# EAGLE design H15R80 (EAGLE 9.3.0)

## Sheet 1 of 2
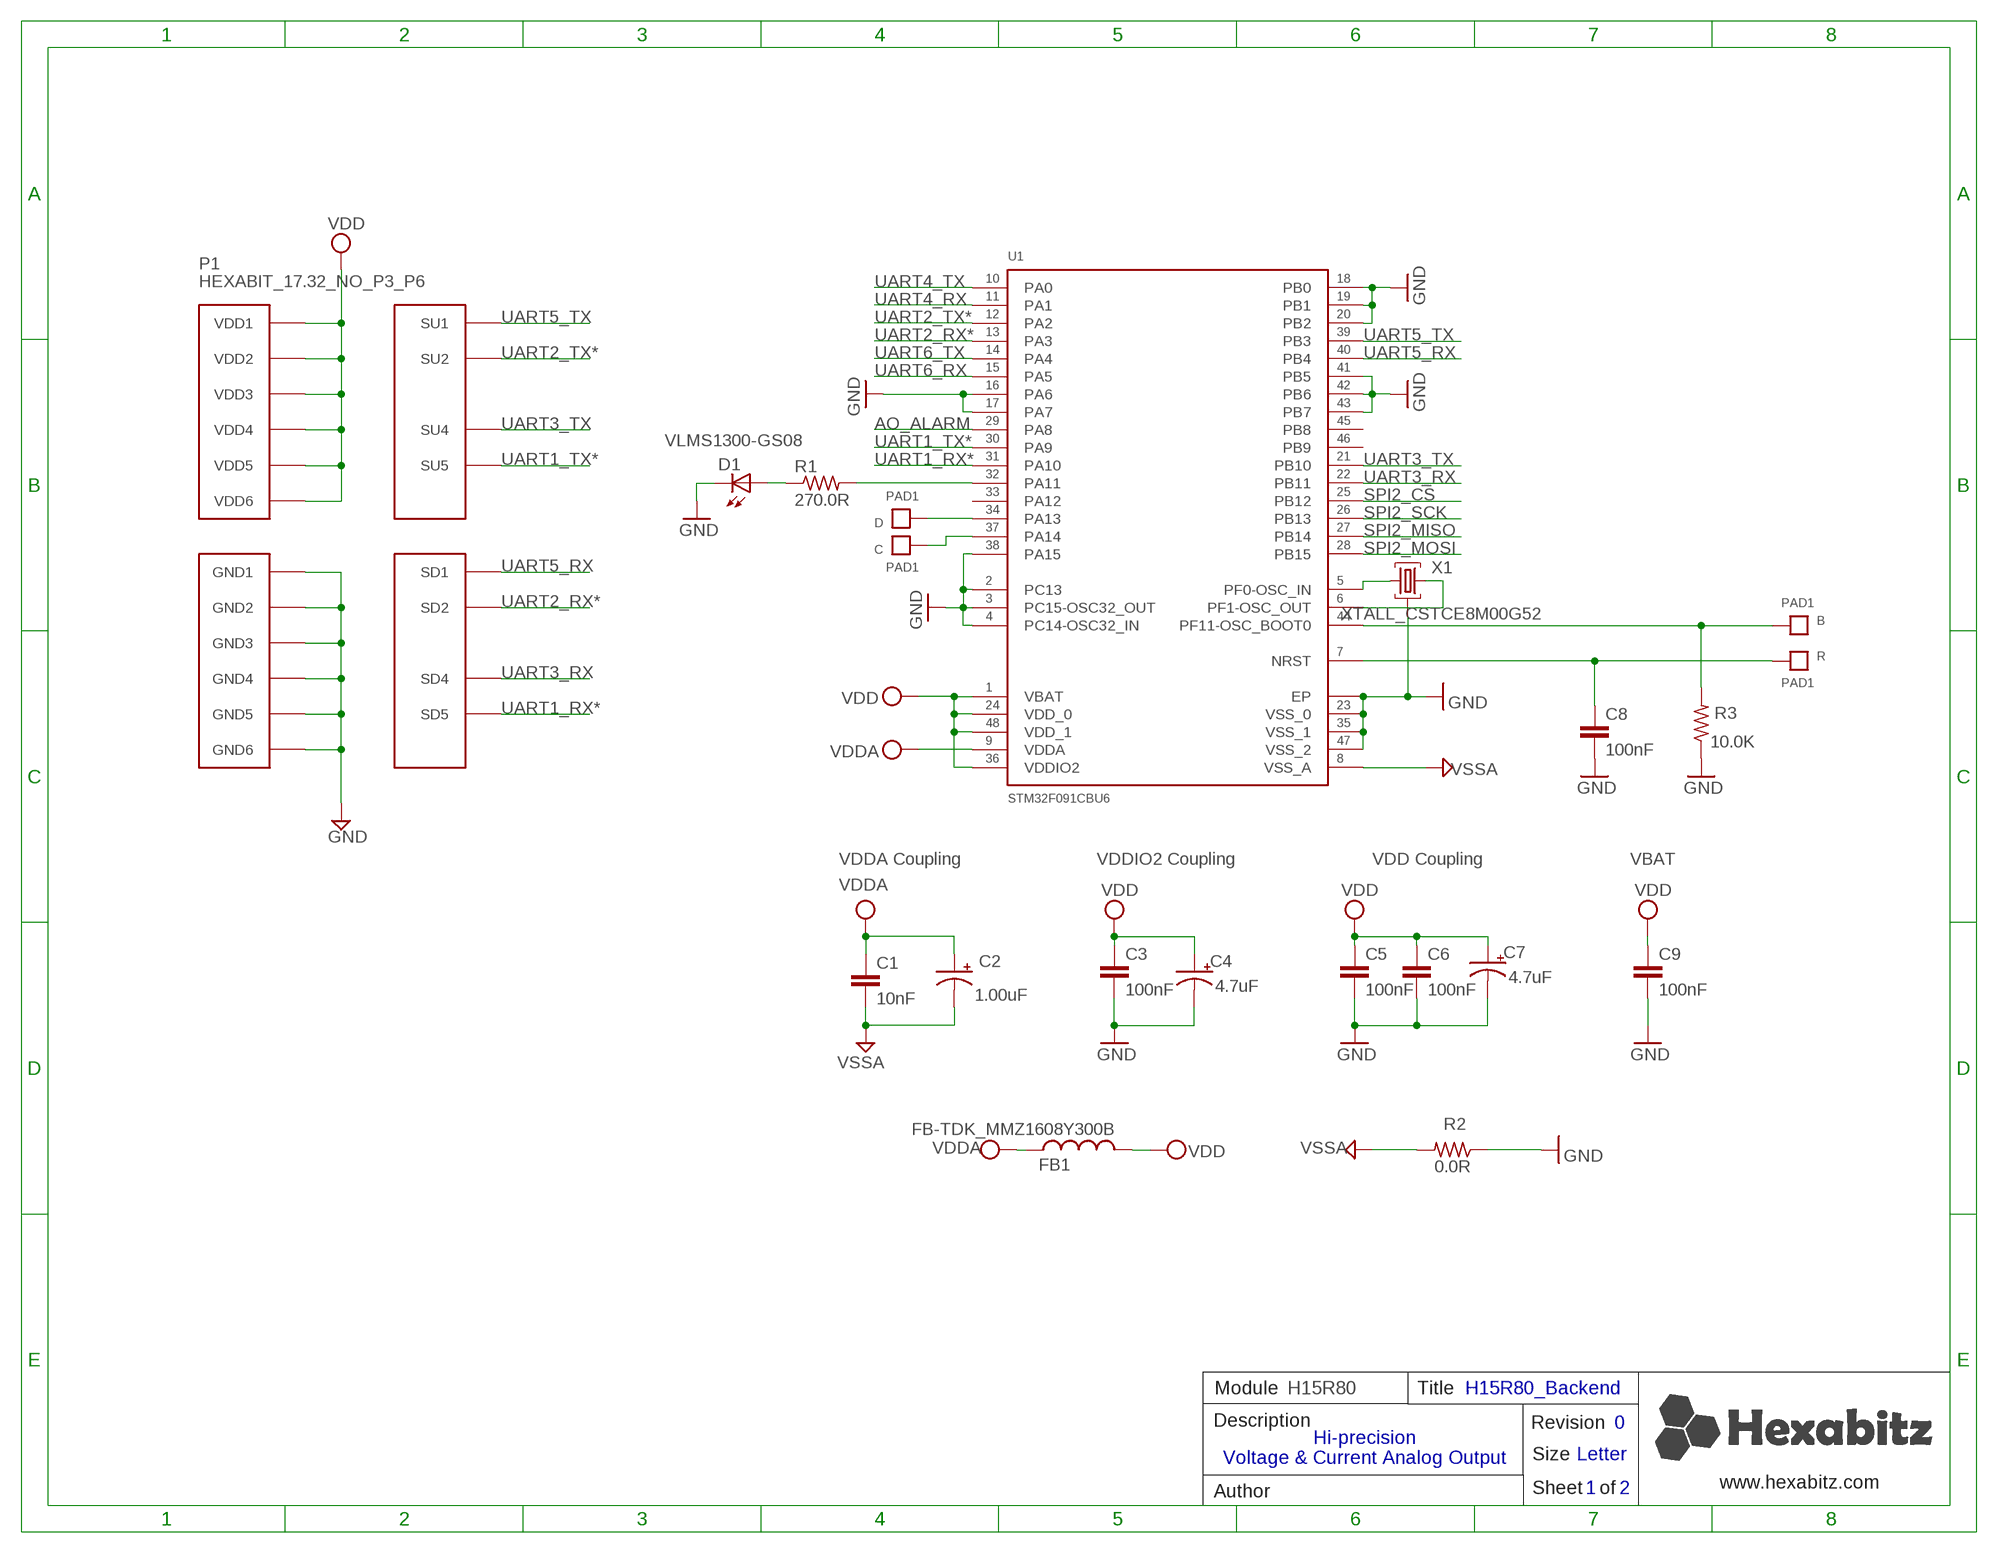
[diagram p0: schematic, sheet 1]

### Parts
B  PAD1  [PAD1]
C  PAD1  [PAD1]
C1  10nF  C-0603  [C-0603]
C2  1.00uF  C-0805-POL  [C-0805-POL]
C3  100nF  C-0603  [C-0603]
C4  4.7uF  C-0805-POL  [C-0805-POL]
C5  100nF  C-0603  [C-0603]
C6  100nF  C-0603  [C-0603]
C7  4.7uF  C-0805-POL  [C-0805-POL]
C8  100nF  C-0603  [C-0603]
C9  100nF  C-0603  [C-0603]
D  PAD1  [PAD1]
D1  VLMS1300-GS08  [VLMS1300-GS08]
FB1  FB-TDK_MMZ1608Y300B  [FB-TDK_MMZ1608Y300B]
P1  HEXABIT_17.32_NO_P3_P6  [HEXABIT_17.32_NO_P3_P6]
R  PAD1  [PAD1]
R1  270.0R  R-0603  [R-0603]
R2  0.0R  R-0603  [R-0603]
R3  10.0K  R-0603  [R-0603]
U1  STM32F091CBU6  [STM32F091CBU6]
X1  XTALL_CSTCE8M00G52  [XTALL_CSTCE8M00G52]

### Nets
AO_ALARM: U1.P$29(PA8) ; also sheet 2
B1: B.P$1 B.P$2 R3.2 U1.P$44(PF11-OSC_BOOT0)
GND: C3.2 C4.2(-) C5.2 C6.2 C7.2(-) C8.2 C9.2 D1.C P1.PAD_PD7(GND1) P1.PAD_PD8(GND2) P1.PAD_PD9(GND3) P1.PAD_PD10(GND4) P1.PAD_PD11(GND5) P1.PAD_PD12(GND6) R2.1 R3.1 U1.EP U1.P$2(PC13) U1.P$3(PC14-OSC32_IN) U1.P$4(PC15-OSC32_OUT) U1.P$16(PA6) U1.P$17(PA7) U1.P$18(PB0) U1.P$19(PB1) U1.P$20(PB2) U1.P$23(VSS_0) U1.P$35(VSS_1) U1.P$38(PA15) U1.P$41(PB5) U1.P$42(PB6) U1.P$43(PB7) U1.P$47(VSS_2) X1.P$2
N$3: R1.2 U1.P$32(PA11)
N$4: D1.A R1.1
N$5: U1.P$5(PF0-OSC_IN) X1.P$1
N$6: U1.P$6(PF1-OSC_OUT) X1.P$3
N$7: D.P$1 D.P$2 U1.P$34(PA13)
N$9: C.P$1 C.P$2 U1.P$37(PA14)
R1: C8.1 R.P$1 R.P$2 U1.P$7(NRST)
SPI2_CS: U1.P$25(PB12) ; also sheet 2
SPI2_MISO: U1.P$27(PB14) ; also sheet 2
SPI2_MOSI: U1.P$28(PB15) ; also sheet 2
SPI2_SCK: U1.P$26(PB13) ; also sheet 2
UART1_RX*: P1.PAD_PD5(SD5) U1.P$31(PA10)
UART1_TX*: P1.PAD_PU5(SU5) U1.P$30(PA9)
UART2_RX*: P1.PAD_PD2(SD2) U1.P$13(PA3)
UART2_TX*: P1.PAD_PU2(SU2) U1.P$12(PA2)
UART3_RX: P1.PAD_PD4(SD4) U1.P$22(PB11)
UART3_TX: P1.PAD_PU4(SU4) U1.P$21(PB10)
UART4_RX: U1.P$11(PA1)
UART4_TX: U1.P$10(PA0)
UART5_RX: P1.PAD_PD1(SD1) U1.P$40(PB4)
UART5_TX: P1.PAD_PU1(SU1) U1.P$39(PB3)
UART6_RX: U1.P$15(PA5)
UART6_TX: U1.P$14(PA4)
VDD: C3.1 C4.1(+) C5.1 C6.1 C7.1(+) C9.1 FB1.2 P1.PAD_PU7(VDD1) P1.PAD_PU8(VDD2) P1.PAD_PU9(VDD3) P1.PAD_PU10(VDD4) P1.PAD_PU11(VDD5) P1.PAD_PU12(VDD6) U1.P$1(VBAT) U1.P$24(VDD_0) U1.P$36(VDDIO2) U1.P$48(VDD_1)
VDDA: C1.1 C2.1(+) FB1.1 U1.P$9(VDDA) ; also sheet 2
VSSA: C1.2 C2.2(-) R2.2 U1.P$8(VSS_A) ; also sheet 2
Unconnected: U1.P$33(PA12) U1.P$45(PB8) U1.P$46(PB9)

### Notes on the sheet
- VDDA Coupling | VDDIO2 Coupling | VDD Coupling | VBAT
- Module | H15R80 | Title | H15R80_Backend
- Description | Revision | 0
- Hi-precision
  Voltage & Current Analog Output
- Size | Letter
- www.hexabitz.com
- Author | Sheet   of | 1 | 2
- C:/Users/Admin/Desktop/logodraft.bmp

## Sheet 2 of 2
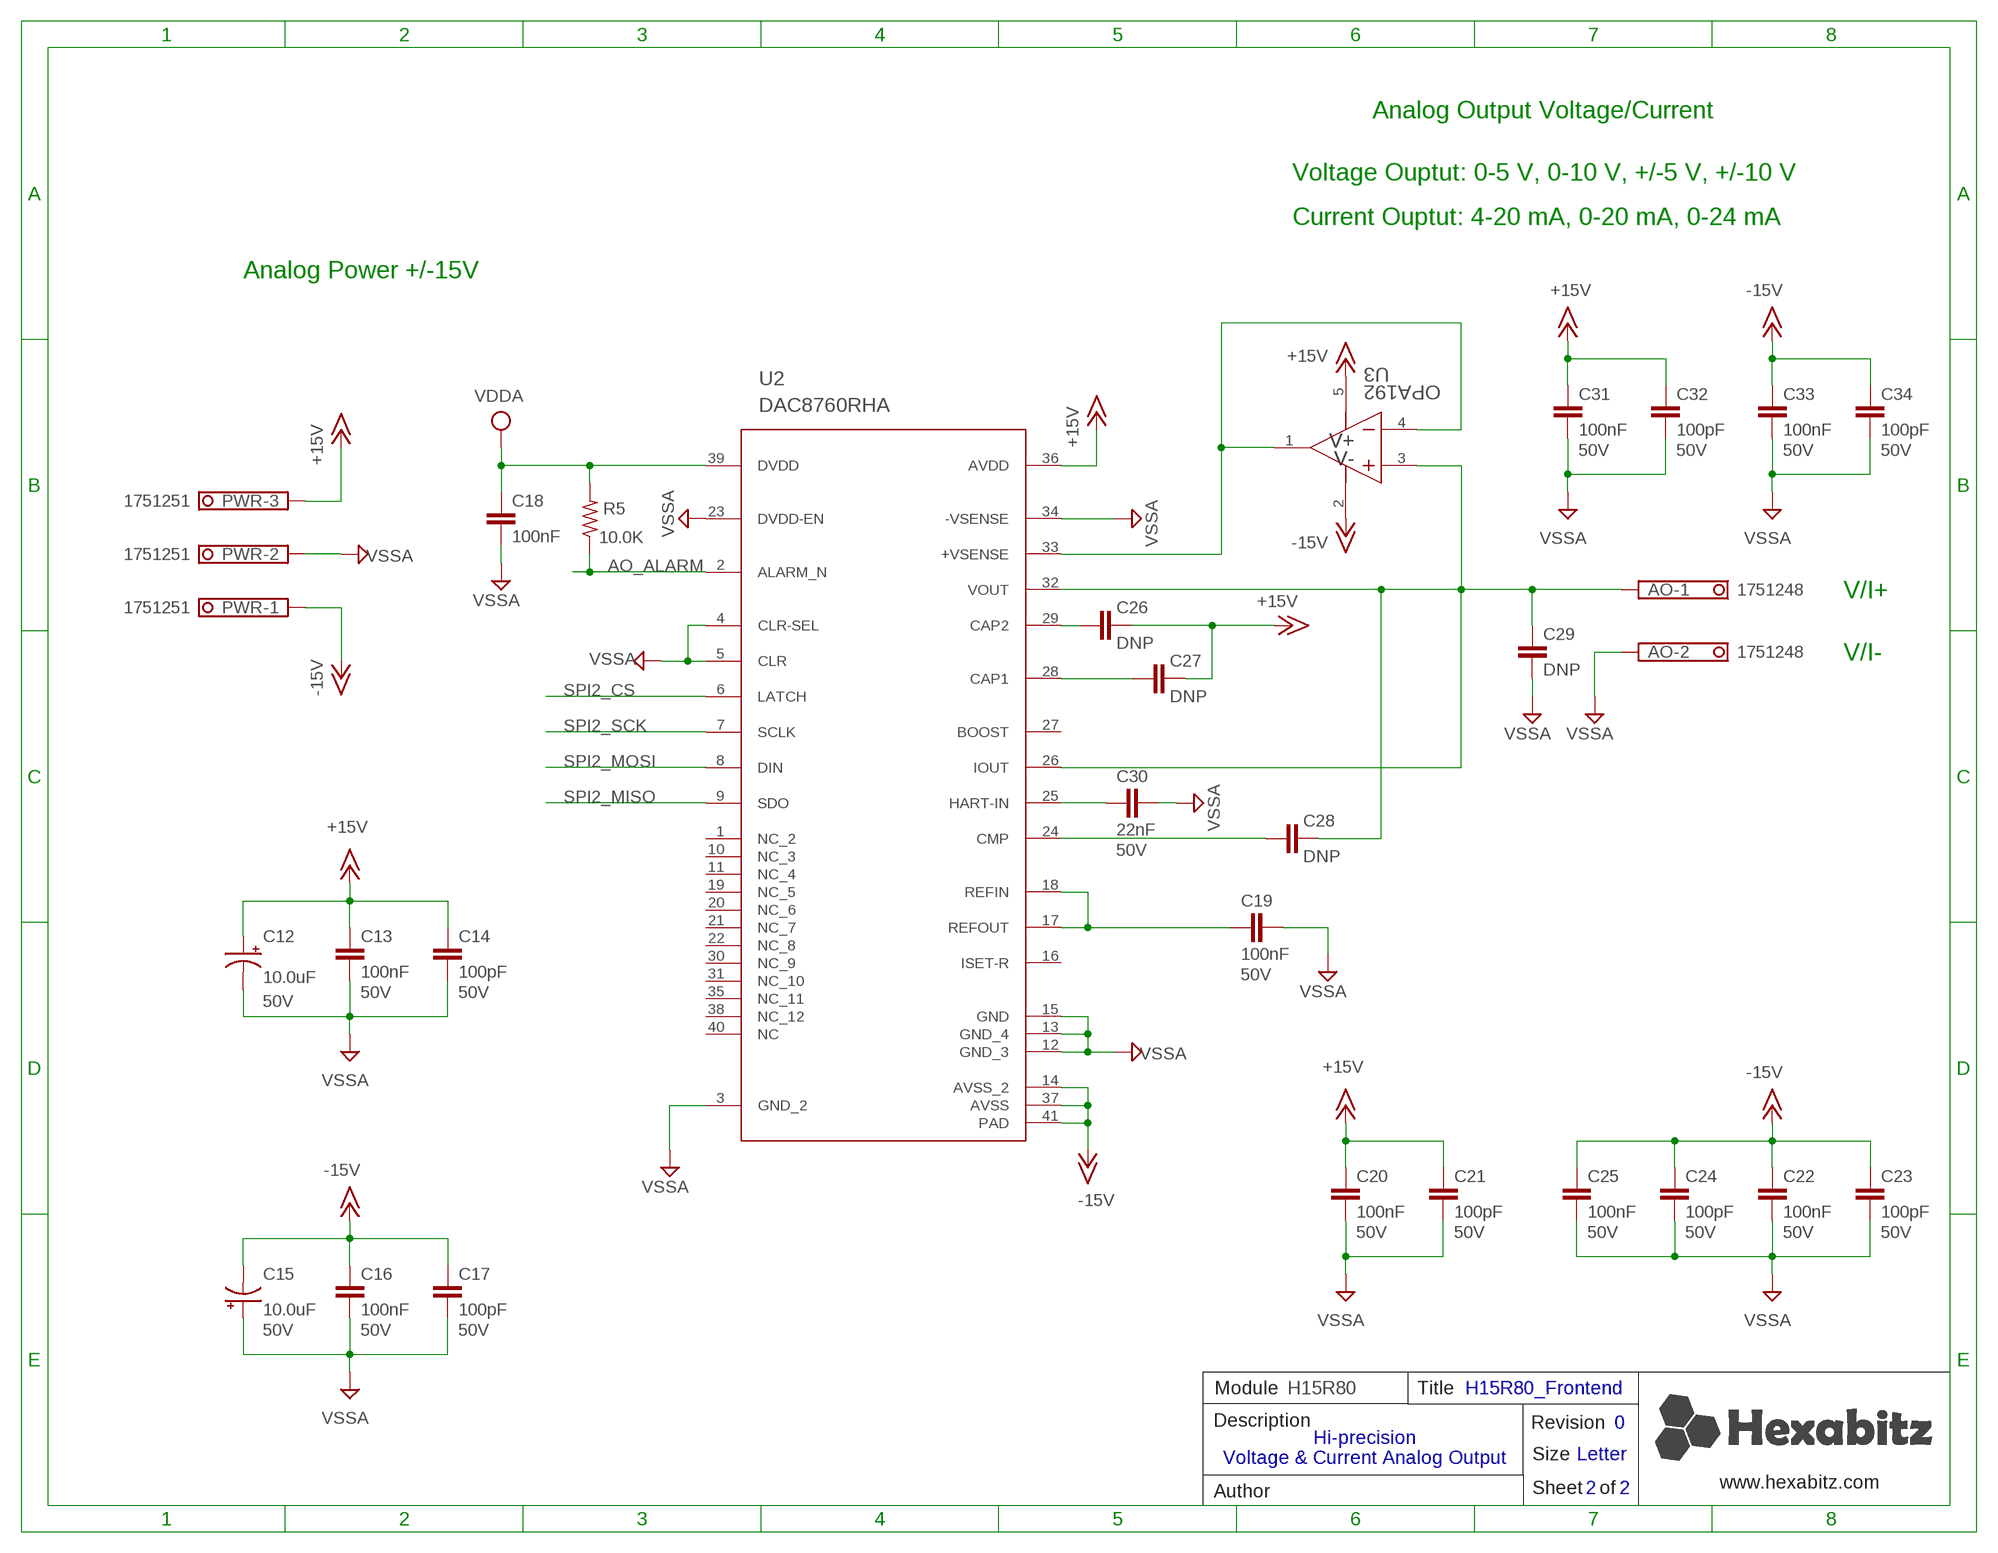
[diagram p1: schematic, sheet 2]

### Parts
AO  1751248  [1751248]
C12  10.0uF  CPOL-USCT7343  [CT7343]
C13  100nF  C-0603  [C-0603]
C14  100pF  C-0603  [C-0603]
C15  10.0uF  CPOL-USCT7343  [CT7343]
C16  100nF  C-0603  [C-0603]
C17  100pF  C-0603  [C-0603]
C18  100nF  C-0603  [C-0603]
C19  100nF  C-0603  [C-0603]
C20  100nF  C-0603  [C-0603]
C21  100pF  C-0603  [C-0603]
C22  100nF  C-0603  [C-0603]
C23  100pF  C-0603  [C-0603]
C24  100pF  C-0603  [C-0603]
C25  100nF  C-0603  [C-0603]
C26  DNP  C-0603  [C-0603]
C27  DNP  C-0603  [C-0603]
C28  DNP  C-0603  [C-0603]
C29  DNP  C-0603  [C-0603]
C30  22nF  C-0603  [C-0603]
C31  100nF  C-0603  [C-0603]
C32  100pF  C-0603  [C-0603]
C33  100nF  C-0603  [C-0603]
C34  100pF  C-0603  [C-0603]
PWR  1751251  [1751251]
R5  10.0K  R-0603  [R-0603]
U2  DAC8760RHA  DAC7760IRHAR  [RHA0040A]
U3  OPA192  OPA192IDBVR  [DBV0005A_N]

### Nets
+15V: C12.+ C13.1 C14.1 C20.1 C21.1 C26.2 C27.2 C31.1 C32.1 PWR.3 U2.36(AVDD) U3.5(V+)
-15V: C15.- C16.1 C17.1 C22.1 C23.1 C24.1 C25.1 C33.1 C34.1 PWR.1 U2.14(AVSS_2) U2.37(AVSS) U2.41(PAD) U3.2(V-)
AO_ALARM: R5.1 U2.2(ALARM_N) ; also sheet 1
N$1: AO.1 C28.2 C29.2 U2.26(IOUT) U2.32(VOUT) U3.3(IN+)
N$2: C19.1 U2.17(REFOUT) U2.18(REFIN)
N$8: C26.1 U2.29(CAP2)
N$10: C27.1 U2.28(CAP1)
N$11: C28.1 U2.24(CMP)
N$13: U2.33(+VSENSE) U3.1(OUT) U3.4(IN-)
N$14: C30.1 U2.25(HART-IN)
SPI2_CS: U2.6(LATCH) ; also sheet 1
SPI2_MISO: U2.9(SDO) ; also sheet 1
SPI2_MOSI: U2.8(DIN) ; also sheet 1
SPI2_SCK: U2.7(SCLK) ; also sheet 1
VDDA: C18.1 R5.2 U2.39(DVDD) ; also sheet 1
VSSA: AO.2 C12.- C13.2 C14.2 C15.+ C16.2 C17.2 C18.2 C19.2 C20.2 C21.2 C22.2 C23.2 C24.2 C25.2 C29.1 C30.2 C31.2 C32.2 C33.2 C34.2 PWR.2 U2.3(GND_2) U2.4(CLR-SEL) U2.5(CLR) U2.12(GND_3) U2.13(GND_4) U2.15(GND) U2.23(DVDD-EN) U2.34(-VSENSE) ; also sheet 1
Unconnected: U2.1(NC_2) U2.10(NC_3) U2.11(NC_4) U2.16(ISET-R) U2.19(NC_5) U2.20(NC_6) U2.21(NC_7) U2.22(NC_8) U2.27(BOOST) U2.30(NC_9) U2.31(NC_10) U2.35(NC_11) U2.38(NC_12) U2.40(NC)

### Notes on the sheet
- Analog Output Voltage/Current
- Voltage Ouptut: 0-5 V, 0-10 V, +/-5 V, +/-10 V
- Current Ouptut: 4-20 mA, 0-20 mA, 0-24 mA
- Analog Power +/-15V
- V/I+
- V/I-
- Module | H15R80 | Title | H15R80_Frontend
- Description | Revision | 0
- Hi-precision
  Voltage & Current Analog Output
- Size | Letter
- www.hexabitz.com
- Author | Sheet   of | 2 | 2

## Library data of the parts
AO = con-phoenix-350:1751248: MKDS 1/ 2-3,5 Printklemme Nennstrom: 10 A Bemessungsspannung: 160 V Raster: 3,5 mm Polzahl: 2 Montageart: Löten Anschlussart: Schraubanschluss Anschlussrichtung vom Leiter zur Platine: 0° Source: http://eshop.phoenixcontact.com .. 1751248.pdf; MFN: Phoenix Contact; MPN: 1751248; OCTOPART_URL: https://octopart.com/1751248-phoenix+contact-31334?r=sp&s=dfbEyNHiQNetUL69ahOrPQ; OC_FARNELL: unknown; OC_NEWARK: unknown
B C D R = Hexabitz:PAD1
C1 = Hexabitz:C-0603: CAP CER 10% X7R 0603; CAPACITANCE: 10nF; MFN: KEMET; MPN: C0603C103K5RACTU; OCTOPART_URL: https://octopart.com/c0603c103k5ractu-kemet-133094?r=sp&s=R_iPBxLnSmGqhkU2rIMFpg; TOLERANCE: 10%; VOLTAGE_RATING: 50V
C2 = Hexabitz:C-0805-POL: Cap Tant Solid SMD 2012; CAPACITANCE: 1.00uF; MFN: Yageo; MPN: CC0805KKX7R7BB105; OCTOPART_URL: https://octopart.com/cc0805kkx7r7bb105-yageo-8376555?r=sp&s=YKl1wwtkROau_X5nniH2ig; TOLERANCE: 10%; VOLTAGE_RATING: 16V
C3 C6 C8 C18 = Hexabitz:C-0603: CAP CER 10% X7R 0603; CAPACITANCE: 100nF; MFN: KEMET; MPN: C0603C104K8RACTU; OCTOPART_URL: https://octopart.com/c0603c104k8ractu-kemet-145075?r=sp&s=9bS9ASSwSEqMCE9KBEQZ0g; TOLERANCE: 10%; VOLTAGE_RATING: 10V
C4 C7 = Hexabitz:C-0805-POL: Cap Tant Solid SMD 2012; CAPACITANCE: 4.7uF; MFN: Murata; MPN: GRM21BC81E475KA12L; OCTOPART_URL: https://octopart.com/grm21bc81e475ka12l-murata-10331911?r=sp&s=RY3qZSD8T6mG6TC9CHI5qQ; TOLERANCE: 10%; VOLTAGE_RATING: 25V
C5 = Hexabitz:C-0603: CAP CER 10% X7R 0603; CAPACITANCE: 100nF; MFN: KEMET; MPN: C0603C104K8RACTU; OCTOPART_URL: https://octopart.com/c0603c104k8ractu-kemet-145075?r=sp&s=9bS9ASSwSEqMCE9KBEQZ0g; TOLERANCE: 10%; VOLTAGE_RATING: 10
C9 = Hexabitz:C-0603: CAP CER 10% X7R 0603; CAPACITANCE: 100nF; MFN: KEMET; MPN: C0603C104K8RACTU; OCTOPART_URL: https://octopart.com/c0603c104k8ractu-kemet-145075?r=sp&s=9bS9ASSwSEqMCE9KBEQZ0g; TOLERANCE: 10V; VOLTAGE_RATING: 10%
C12 C15 = rcl:CPOL-US: POLARIZED CAPACITOR, American symbol; CAPACITANCE: 10.0uF; MFN: KEMET; MPN: T491D106K050AT; OCTOPART_URL: https://octopart.com/t491d106k050at-kemet-968220?r=ap&s=K_G_zr40QourN4WdchG6mQ#; SPICEPREFIX: C; VOLTAGE: 50V
C13 C16 C19 C20 C22 C25 C31 C33 = Hexabitz:C-0603: CAP CER 10% X7R 0603; CAPACITANCE: 100nF; MFN: Samsung; MPN: CL10B104KB8NNNC; OCTOPART_URL: https://octopart.com/cl10b104kb8nnnc-samsung-7928277?r=sp&s=fIKkgin8S22eXTUxF1gXsw; TOLERANCE: 10%; VOLTAGE_RATING: 50V
C14 C17 C21 C23 C24 C32 C34 = Hexabitz:C-0603: CAP CER 10% X7R 0603; CAPACITANCE: 100pF; MFN: Avx; MPN: 06035A101JAT2A; OCTOPART_URL: https://octopart.com/06035a101jat2a-avx-55386344?r=sp&s=WDfgRo-ITV2A4U5JT5ZyKQ; TOLERANCE: 10%; VOLTAGE_RATING: 50V
C26-C29 = Hexabitz:C-0603: CAP CER 10% X7R 0603; CAPACITANCE: DNP; MPN: DNP
C30 = Hexabitz:C-0603: CAP CER 10% X7R 0603; CAPACITANCE: 22nF; MFN: TDK; MPN: C1608X7R1H223K080AA; OCTOPART_URL: https://octopart.com/c1608x7r1h223k080aa-tdk-25947667?r=sp&s=T8cT_uRxS7ewuHBmxCxszg; TOLERANCE: 10%; VOLTAGE_RATING: 50V
D1 = Hexabitz:VLMS1300-GS08: Red 0603 130° Clear 54 mcd 2 V Surface Mount ChipLED ; Octopart Url : http://octopart.com/vlms1300-gs08-vishay-21709201; MFN: Vishay; MPN: VLMS1300-GS08; OCTOPART_URL: https://octopart.com/vlms1300-gs08-vishay-21709201?r=sp&s=_gcP4_q8T1SC6PJQPTQ9yA
FB1 = Hexabitz:FB-TDK_MMZ1608Y300B: Ferrite Beads Multi-Layer 30Ohm 25% 100MHz 1.5A 50mOhm DCR 0603; MFN: TDK; MPN: MMZ1608Y300B; OCTOPART_URL: https://octopart.com/mmz1608y300b-tdk-368280?r=sp&s=cd9_2ZEqQ9q9UNBuQgHAiA
P1 = hexabitz_connectors:HEXABIT_?_NO_P3_P6: Hexabitz Hexagon Module Connector Hexagon side length = 17.32mm. The following ports are removed: P3 P6
PWR = con-phoenix-350:1751251: MKDS 1/ 3-3,5 Printklemme Nennstrom: 10 A Bemessungsspannung: 160 V Raster: 3,5 mm Polzahl: 3 Montageart: Löten Anschlussart: Schraubanschluss Anschlussrichtung vom Leiter zur Platine: 0° Source: http://eshop.phoenixcontact.com .. 1751251.pdf; MFN: Phoenix Contact; MPN: 1751251; OCTOPART_URL: https://octopart.com/1751251-phoenix+contact-36473?r=sp&s=9M0VWNoHTyq04j3qI6lQOQ; OC_FARNELL: unknown; OC_NEWARK: unknown
R1 = Hexabitz:R-0603: Thick Film Resistors - SMD 0603; MFN: Yageo; MPN: RC0603FR-07270RL; OCTOPART_URL: https://octopart.com/search?q=RC0603FR-07270RL&start=0; RESISTANCE: 270.0 Ohm; TOLERANCE: 1%
R2 = Hexabitz:R-0603: Thick Film Resistors - SMD 0603; MFN: Yageo; MPN: RC0603JR-070RL; OCTOPART_URL: https://octopart.com/rc0603jr-070rl-yageo-1241539?r=sp&s=X2NteqRjRNWrnx42Y0aliA; RESISTANCE: 0.0 Ohm
R3 R5 = Hexabitz:R-0603: Thick Film Resistors - SMD 0603; MFN: Yageo; MPN: RC0603JR-0710KL; OCTOPART_URL: https://octopart.com/search?q=RC0603JR-0710KL&start=0; RESISTANCE: 10.0K Ohm; TOLERANCE: 5%
U1 = Hexabitz:STM32F091CBU6: Description : ARM-based 32-bit MCU, CAN, 12 timers, ADC, DAC & Comm. Interface, 2 to 3.6 V, -40 to 85 degC, 48-Pin UFQFPN, RoHS, Tray ;Parameter : Ciiva URL : https://ciiva.com/part/STM32F091CBU6-20240708, CiivaID : 20240708, Clock Speed : 48000000.0 Hz, Lifecycle Status : Active, Mounting Style : Surface Mount, Number of Pins : 48, Octopart Url : https://octopart.com/stm32f091cbu6-stmicroelectronics-51988677, OctopartID : 5f4f955c32ec8088, RAM Memory Size : 32768 B, REACH SVHC Compliance : No SVHC, RoHS : Compliant,; MFN: STMicroelectronics; MPN: STM32F091CBU6; OCTOPART_URL: https://octopart.com/stm32f091cbu6-stmicroelectronics-51988677?r=sp&s=bU6fpgsrTZOxHyt7jkfh3w
U2 = Hexabitz:DAC7760IRHAR: 16-Bit Single-Channel Programmable Current/Voltage Output DAC for 4-20mA current loop applications; MANUFACTURER: Texas Instruments; MFN: Texas Instruments; MPN: DAC8760IRHAR; OCTOPART_URL: https://octopart.com/dac8760irhar-texas+instruments-29661993?r=sp&s=ruhaz_LcRdqODQmkWKrlGA; PARTNUMBER: DAC7760IRHAR; REFDES: RefDes; TYPE: TYPE
U3 = Hexabitz:OPA192IDBVR; ALTERNATE_PARTNUMBER: OPA192IDBVT; APPLICATION_BUILDNUMBER: *; COMPTYPE: IC; MANUFACTURER: Texas Instruments; MFN: Texas Instruments; MOUNTTYPE: SMT; MPN: OPA192IDBVR; OCTOPART_URL: https://octopart.com/opa192idbvr-texas+instruments-33513820?r=sp&s=D6KF1OAATrGkqNyouFfzCw; PACKAGEREFERENCE: DBV0005A; PARTNUMBER: OPA192IDBVR; PIN_COUNT: 5; REFDES: RefDes; ROHS: Y; TYPE: TYPE; VALUE: Value
X1 = Hexabitz:XTALL_CSTCE8M00G52: MURATA CSTCE8M00G52-R0 RESONATOR, SMD, 8MHZ ; Octopart Url : https://octopart.com/cstce8m00g52-r0-murata-7145559; MFN: Murata; MPN: CSTCE8M00G52Z-R0; OCTOPART_URL: https://octopart.com/cstce8m00g52z-r0-murata-17755941?r=sp&s=JDnNJnrHQhyS8Zk4ofFWXw

## Board
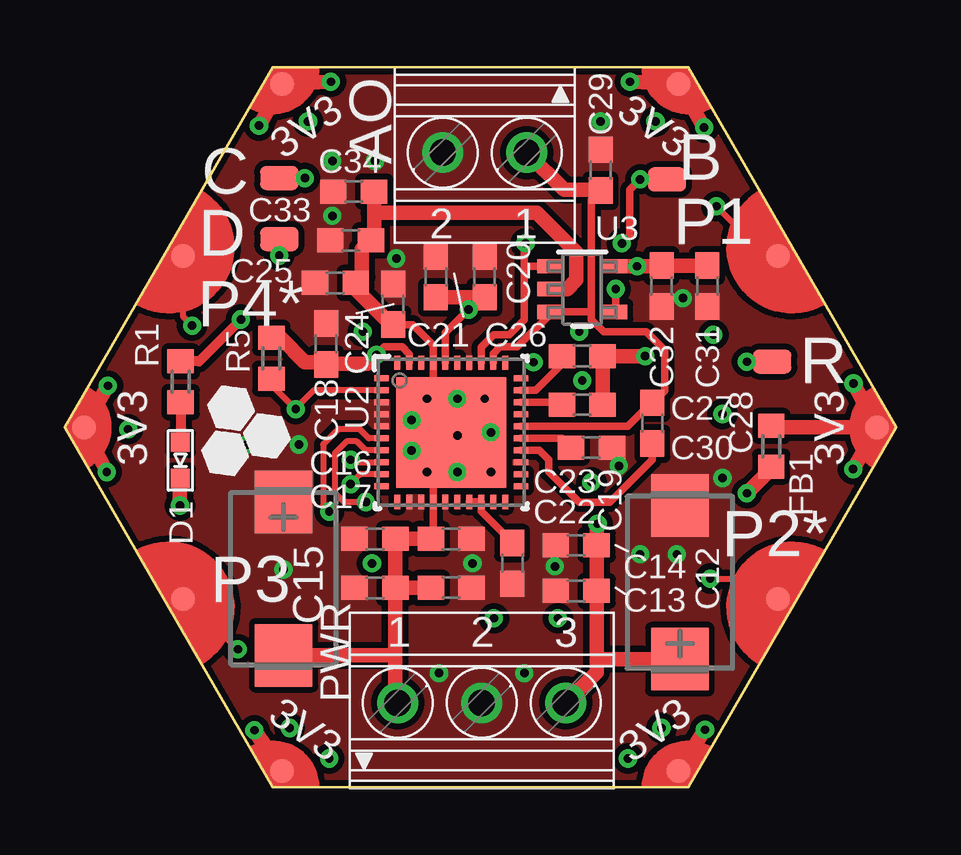
[diagram p2: board, top side]
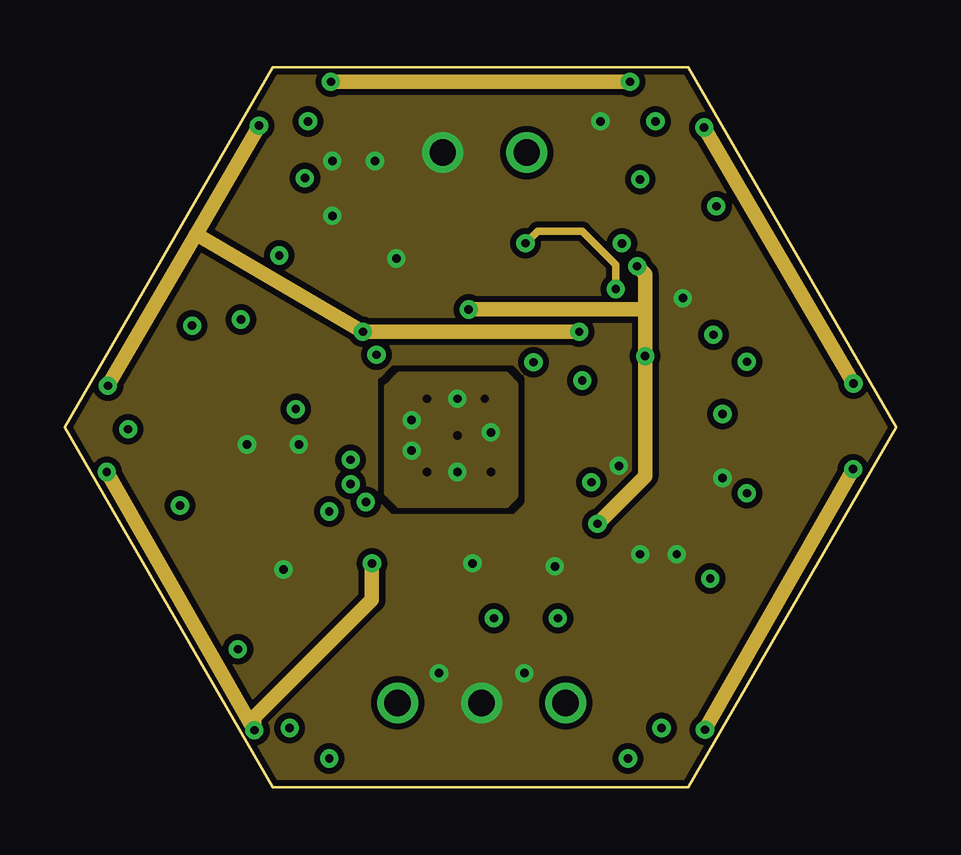
[diagram p3: board, inner layer Route2]
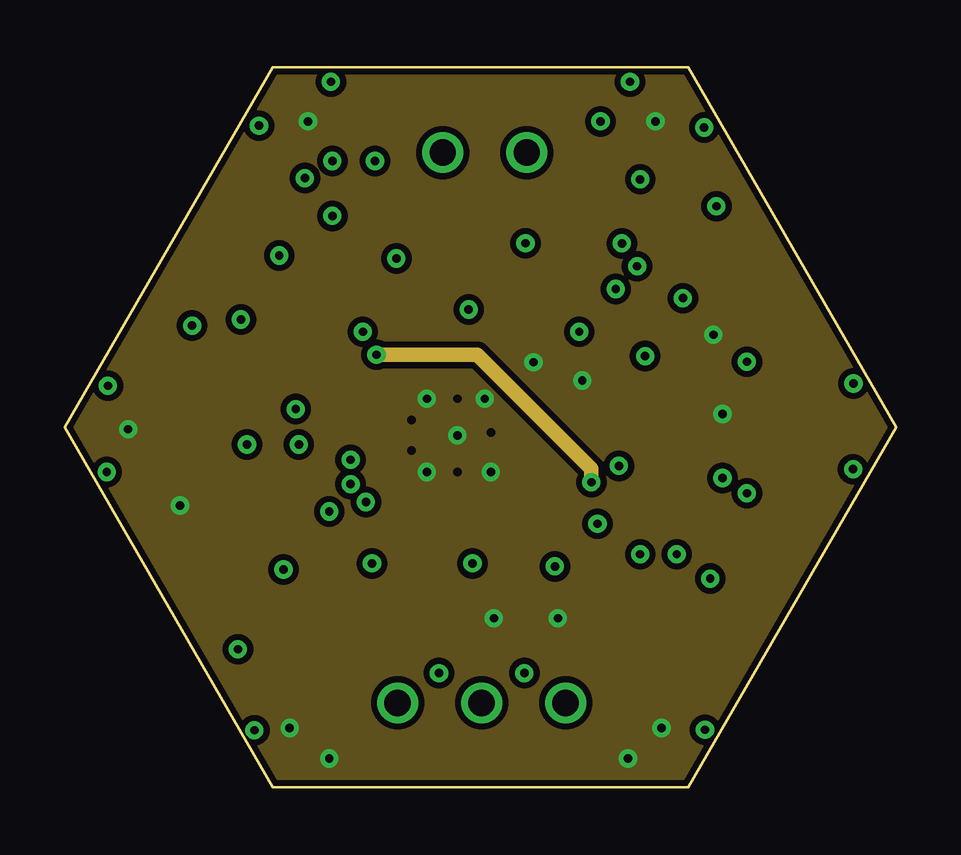
[diagram p4: board, inner layer Route15]
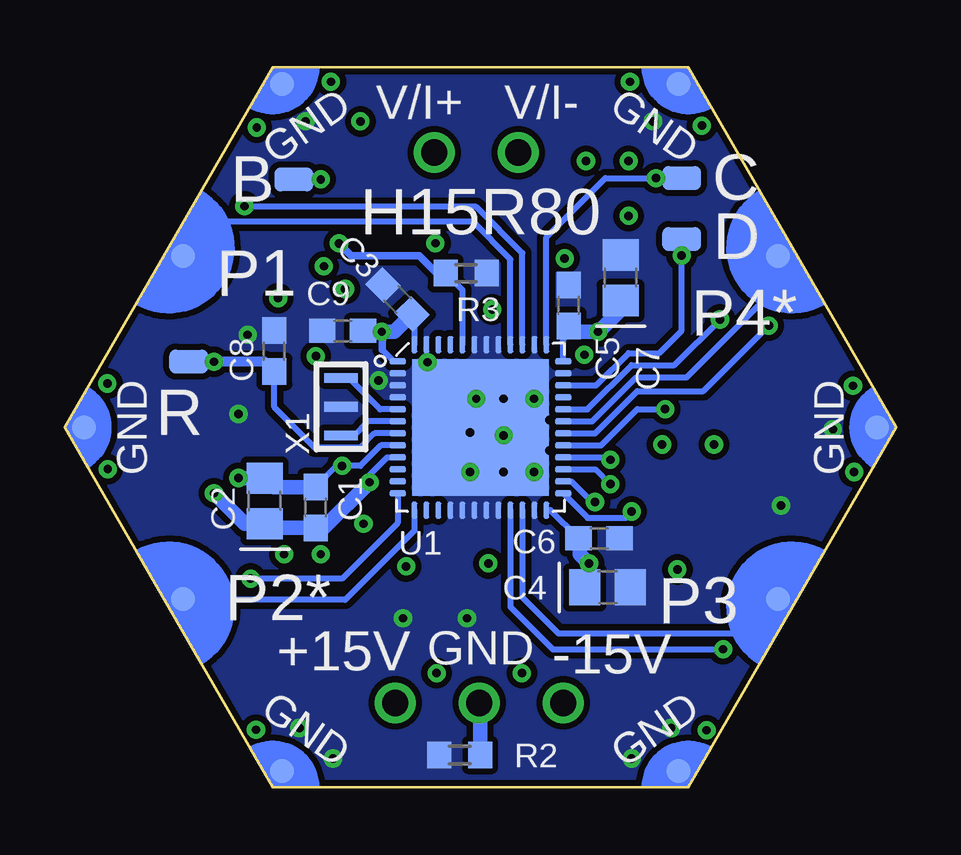
[diagram p5: board, bottom side, seen from below]

Size 34.64 x 30 mm. Coordinates in mm from the lower left corner, seen from the top.
Copper layers ([2:1+2*15+16:15]): Top 0.035mm / dielectric 0.175mm / Route2 0.035mm / dielectric 1.11mm / Route15 0.035mm / dielectric 0.175mm / Bottom 0.035mm
Design rules "2_layer *": minimum track width 7mil, minimum drill 10mil, track to track 6mil, track to pad 6mil, pad to pad 6mil, via to via 6mil, smd to smd 0mil, copper to edge 1mil, drill to drill 8mil, minimum pad ring 10mil, minimum via ring 8mil, stop-mask expansion 2mil, vias tented up to drill 15mil, thermal gap 10mil

### Footprints (pad centres in the part's own frame; a part is rotated, then mirrored left to right if it is on the bottom)
1751248 = drill 1.1 pad 1.7: 1 -1.75,-0.1; 2 1.75,-0.1
PAD1 = smd 1.6 x 1: P$1 0,0 | smd 1.6 x 1 bottom: P$2 0,0
C-0603 = smd 1.1 x 1: 1 -0.85,0; 2 0.85,0
C-0805-POL = smd 1.3 x 1.5: 1 -0.95,0; 2 0.95,0
CT7343 = smd 2.6 x 2.4: + -3.2,0; - 3.2,0
VLMS1300-GS08 = smd 0.8 x 0.8: A 0,0.75; C 0,-0.75
FB-TDK_MMZ1608Y300B = smd 1 x 1.1: 1 -0.85,0; 2 0.85,0
HEXABIT_17.32_NO_P3_P6 = smd 1 x 1 bottom: PAD_PD1 12.39,7.15; PAD_PD2 12.39,-7.15; PAD_PD4 -12.39,-7.15; PAD_PD5 -12.39,7.15; PAD_PD7 8.26,14.31; PAD_PD8 16.52,0; PAD_PD9 8.26,-14.31; PAD_PD10 -8.26,-14.31; PAD_PD11 -16.52,0; PAD_PD12 -8.26,14.31 | smd 1 x 1: PAD_PU1 12.39,7.15; PAD_PU2 12.39,-7.15; PAD_PU4 -12.39,-7.15; PAD_PU5 -12.39,7.15; PAD_PU7 8.26,14.31; PAD_PU8 16.52,0; PAD_PU9 8.26,-14.31; PAD_PU10 -8.26,-14.31; PAD_PU11 -16.52,0; PAD_PU12 -8.26,14.31
1751251 = drill 1.1 pad 1.7: 1 -3.5,-0.1; 2 0,-0.1; 3 3.5,-0.1
R-0603 = smd 1 x 1.1: 1 -0.85,0; 2 0.85,0
STM32F091CBU6 = smd 5.7 x 5.7: EP 0,0 | smd 0.25 x 0.7: P$1 -2.75,-3.45; P$2 -2.25,-3.45; P$3 -1.75,-3.45; P$4 -1.25,-3.45; P$5 -0.75,-3.45; P$6 -0.25,-3.45; P$7 0.25,-3.45; P$8 0.75,-3.45; P$9 1.25,-3.45; P$10 1.75,-3.45; P$11 2.25,-3.45; P$12 2.75,-3.45; P$25 2.75,3.45; P$26 2.25,3.45; P$27 1.75,3.45; P$28 1.25,3.45; P$29 0.75,3.45; P$30 0.25,3.45; P$31 -0.25,3.45; P$32 -0.75,3.45; P$33 -1.25,3.45; P$34 -1.75,3.45; P$35 -2.25,3.45; P$36 -2.75,3.45 | smd 0.7 x 0.25: P$13 3.45,-2.75; P$14 3.45,-2.25; P$15 3.45,-1.75; P$16 3.45,-1.25; P$17 3.45,-0.75; P$18 3.45,-0.25; P$19 3.45,0.25; P$20 3.45,0.75; P$21 3.45,1.25; P$22 3.45,1.75; P$23 3.45,2.25; P$24 3.45,2.75; P$37 -3.45,2.75; P$38 -3.45,2.25; P$39 -3.45,1.75; P$40 -3.45,1.25; P$41 -3.45,0.75; P$42 -3.45,0.25; P$43 -3.45,-0.25; P$44 -3.45,-0.75; P$45 -3.45,-1.25; P$46 -3.45,-1.75; P$47 -3.45,-2.25; P$48 -3.45,-2.75
RHA0040A = smd 0.6 x 0.25: 1 -2.9,2.25; 2 -2.9,1.75; 3 -2.9,1.25; 4 -2.9,0.75; 5 -2.9,0.25; 6 -2.9,-0.25; 7 -2.9,-0.75; 8 -2.9,-1.25; 9 -2.9,-1.75; 10 -2.9,-2.25; 21 2.9,-2.25; 22 2.9,-1.75; 23 2.9,-1.25; 24 2.9,-0.75; 25 2.9,-0.25; 26 2.9,0.25; 27 2.9,0.75; 28 2.9,1.25; 29 2.9,1.75; 30 2.9,2.25 | smd 0.25 x 0.6: 11 -2.25,-2.9; 12 -1.75,-2.9; 13 -1.25,-2.9; 14 -0.75,-2.9; 15 -0.25,-2.9; 16 0.25,-2.9; 17 0.75,-2.9; 18 1.25,-2.9; 19 1.75,-2.9; 20 2.25,-2.9; 31 2.25,2.9; 32 1.75,2.9; 33 1.25,2.9; 34 0.75,2.9; 35 0.25,2.9; 36 -0.25,2.9; 37 -0.75,2.9; 38 -1.25,2.9; 39 -1.75,2.9; 40 -2.25,2.9 | smd 4.6 x 4.6: 41 0,0
DBV0005A_N = smd 1 x 0.6: 1 -1.375,0.95; 2 -1.375,0; 3 -1.375,-0.95; 4 1.375,-0.95; 5 1.375,0.95
XTALL_CSTCE8M00G52 = smd 1.4 x 0.4: P$1 0,1.2; P$2 0,0; P$3 0,-1.2

### Placement (x,y rotation side)
AO  17.5,26.35 180 top
B  25.09,25.34 0 top
C  8.94,25.39 0 top
C1  24.19,11.66 90 bottom
C2  26.31,11.94 90 bottom
C3  20.78,20.33 135 bottom
C4  12.02,8.34 0 bottom
C5  13.64,20.08 90 bottom
C6  12.38,10.37 0 bottom
C7  11.48,21.23 90 bottom
C8  25.91,18.18 90 bottom
C9  23.06,19.03 180 bottom
C12  25.63,8.55 90 top
C13  21.31,8.19 180 top
C14  21.31,10.1 180 top
C15  9.12,8.7 270 top
C16  12.93,10.35 180 top
C17  12.93,8.32 180 top
C18  10.89,18.48 90 top
C19  18.64,9.34 270 top
C20  17.5,21.27 90 top
C21  15.47,21.27 90 top
C22  16.1,8.32 0 top
C23  16.1,10.35 0 top
C24  13.69,20.13 90 top
C25  11.27,21.02 180 top
C26  21.56,17.97 0 top
C27  21.56,15.94 0 top
C28  24.48,15.18 90 top
C29  22.32,25.72 270 top
C30  21.94,14.16 0 top
C31  26.77,20.89 270 top
C32  24.86,20.89 270 top
C33  11.91,22.8 180 top
C34  12.04,24.83 180 top
D  8.94,22.85 180 top
D1  4.82,13.63 0 top
FB1  29.43,14.21 90 top
P1  17.32,15 0 top
PWR  17.37,3.62 0 top
R  29.48,17.74 0 top
R1  4.83,16.9 90 top
R2  18.18,1.35 0 bottom
R3  17.92,21.43 180 bottom
R5  8.61,17.88 90 top
U1  17.32,15 270 bottom
U2  16.1,14.8 0 top
U3  21.56,20.77 0 top
X1  23.13,15.86 0 bottom

### Tracks (layer width: path | path; a pad name or v marks a point on that pad's centre or on a via)
+15V  (via drill 0.35)
  Top 0.305: v16.83,19.92 15.85,18.94 U2.36
  Top 0.61: U3.5 v23.85,21.72 24.84,21.72 C32.1 C31.1 | PWR.3 22.16,4.81 22.16,5.4 | 22.16,5.4 C13.1 C14.1 22.16,10.95 v22.2,10.99 | C12.+ 22.21,5.35 22.16,5.4 | C27.2 C26.2 v24.18,17.97 | C21.1 16.86,20.42 | 16.86,20.42 C20.1 | v16.83,19.92 16.86,19.95 16.86,20.42
  Route2 0.61: v22.2,10.99 24.18,12.97 v24.18,17.97 24.18,19.92 | v23.85,21.72 24.18,21.38 24.18,19.92 | v16.83,19.92 24.18,19.92
-15V  (via drill 0.35 layers 1-2)
  Top 0.254: U2.41 14.96,14.8 v14.45,15.3
  Top 0.305: C24.1 14.5,19.28 15.35,18.43 U2.37 15.35,15.55 U2.41 15.35,14.05 U2.14 15.35,10.45 C23.1
  Top 0.61: U3.2 20.93,20.77 21.31,21.15 21.31,22.29 19.66,23.94 12.89,23.94 | C34.1 12.89,23.94 | 12.89,23.94 12.89,22.92 C33.1 12.38,22.42 12.38,21.27 C25.1 12.12,20.77 13.61,19.28 C24.1 | PWR.1 13.78,3.62 13.78,5.53 | 13.78,5.53 C17.1 | C17.1 C22.1 | C17.1 C16.1 C23.1 | C15.- 13.75,5.5 13.78,5.53
  other vias: 14.45,14.03 16.35,13.15 16.35,16.19 17.75,14.8
  pour Route2: 13.94,17.21 18.39,17.21 18.77,16.83 18.77,12.13 18.39,11.75 13.94,11.75 13.43,12.26 13.43,16.7
AO_ALARM  (via drill 0.35)
  Top 0.254: U2.2 10.37,16.55 9.62,15.8 v9.62,15.76 8.61,16.78 R5.1
  Bottom 0.254: U1.P$29 12.29,14.25 10.78,15.76 v9.62,15.76
B1  (via drill 0.35)
  Top 0.305: v23.21,22.67 23.53,22.99 23.53,24.89 v23.97,25.34 B.P$1
  Bottom 0.254: R3.2 18.07,20.73 U1.P$44
  Bottom 0.305: v23.21,22.67 22.7,22.16 19.88,22.16 19.15,21.43 R3.2 | B.P$1 v23.97,25.34
GND  (via drill 0.35, 0.35 layers 15-16)
  Top 0.61: D1.C v4.8,11.75
  other vias: 24.61,27.75 10.13,27.75 2.64,14.92 23.47,1.21 24.86,2.48 9.37,2.48 11.02,1.21 17.88,7.05 20.55,7.05 21.56,16.96 27.02,18.86 27.4,15.56 19.53,17.72 15.08,16.19 17.5,16.19 17.75,13.15 15.08,13.15 16.35,14.67
  pour Bottom (isolate 0.254, no thermals): 8.66,0 25.98,0 34.64,15 25.98,30 8.66,30 0,15
  pour Route15 (isolate 0.254, no thermals): 8.66,0 25.98,0 34.64,15 25.98,30 8.66,30 0,15
N$1
  Top 0.305: U2.32 17.85,18.07 18.13,18.35 18.86,18.35 20.19,19.68 U3.3 21.88,19.82 21.94,19.75 | U2.26 23.47,15.05 24.44,16.03 C28.2 24.99,16.54 24.99,18.23 24.23,18.99 22.45,18.99 21.94,19.5 21.94,19.75 | 21.94,19.75 21.94,24.49 C29.2
  Top 0.61: AO.1 20.81,24.89 22.3,24.89 C29.2
N$2
  Top 0.305: U2.17 U2.18 17.35,11.51 18.64,10.22 C19.1
N$3  (via drill 0.35)
  Top 0.406: R1.2 5.6,17.75 v7.34,19.5
  Bottom 0.254: U1.P$32 12.86,15.75 11.02,17.59 9.24,17.59 v7.34,19.5
N$4
  Top 0.406: R1.1 D1.A
N$5
  Bottom 0.254: U1.P$5 21.5,15.75 22.81,17.06 X1.P$1
N$6
  Bottom 0.254: U1.P$6 22,15.25 22.59,14.66 X1.P$3
N$7  (via drill 0.35)
  Top 0.254: D.P$1 v8.94,22.16
  Bottom 0.254: U1.P$34 12.5,16.75 11.15,18.1 9.88,18.1 8.94,19.04 v8.94,22.16 D.P$1
N$8
  Top 0.305: U2.29 19.63,16.55 20.71,17.63 C26.1
N$9  (via drill 0.35)
  Top 0.254: C.P$1 v10,25.39
  Bottom 0.254: U1.P$37 14.57,22.93 12.11,25.39 v10,25.39 C.P$1
N$10
  Top 0.305: C27.1 20.6,16.05 U2.28
N$11
  Top 0.305: U2.24 19.77,14.05 20.16,13.65 20.16,13.15 21.43,11.88 22.7,11.88 24.48,13.65 C28.1
N$13  (via drill 0.35)
  Top 0.305: U2.33 17.35,18.33 17.88,18.86 18.51,18.86 19.15,19.5 19.15,21.65 | v22.96,20.77 22.96,19.84 U3.4 | v19.2,22.67 19.15,22.62 19.15,21.65 | U3.1 19.21,21.72 19.15,21.65
  Route2 0.305: v19.2,22.67 19.7,23.18 21.56,23.18 22.96,21.78 v22.96,20.77
N$14
  Top 0.305: U2.25 20.71,14.55 C30.1
R1  (via drill 0.35)
  Top 0.406: R.P$1 v28.42,17.74
  Bottom 0.254: U1.P$7 21.74,14.75 22.32,14.16 24.23,14.16 25.91,15.84 C8.1
  Bottom 0.406: C8.1 26.31,17.74 v28.42,17.74 R.P$1
SPI2_CS  (via drill 0.35)
  Top 0.254: v11.02,11.49 10.77,11.75 10.77,14.29 11.4,14.92 12.29,14.92 12.67,14.55 U2.6
  Bottom 0.254: v11.02,11.49 11.02,11.47 11.26,11.23 12.85,11.23 U1.P$25
SPI2_MISO  (via drill 0.35)
  Top 0.254: U2.9 12.32,13.05 v11.91,12.64
  Bottom 0.254: U1.P$27 12.52,13.25 v11.91,12.64
SPI2_MOSI  (via drill 0.35)
  Top 0.254: v11.91,13.65 12.02,13.55 U2.8
  Bottom 0.254: U1.P$28 12.01,13.75 v11.91,13.65
SPI2_SCK  (via drill 0.35)
  Top 0.254: v12.54,11.89 11.64,11.89 11.25,12.28 11.25,13.93 11.74,14.42 12.16,14.42 12.53,14.05 U2.7
  Bottom 0.254: U1.P$26 13.54,12.75 12.67,11.89 v12.54,11.89
UART1_RX*
  Bottom 0.254: U1.P$31 12.67,15.25 10.84,17.08 8.73,17.08 4.93,20.89 P1.PAD_PD5
UART1_TX*  (via drill 0.35)
  Top 0.254: v5.31,19.24 4.93,19.62 P1.PAD_PU5
  Bottom 0.254: U1.P$30 12.54,14.75 10.78,16.51 8.04,16.51 v5.31,19.24
UART2_RX*
  Bottom 0.254: U1.P$13 20.07,10.7 22.96,7.81 29.67,7.81 P1.PAD_PD2
UART2_TX*  (via drill 0.35)
  Top 0.254: v26.9,8.7 28.86,8.7 P1.PAD_PU2
  Bottom 0.254: U1.P$12 20.77,11.02 23.09,8.7 v26.9,8.7
UART3_RX
  Bottom 0.254: U1.P$22 15.57,7.92 14.07,6.41 6.36,6.41 P1.PAD_PD4
UART3_TX  (via drill 0.35)
  Top 0.254: v7.21,5.76 5.12,7.85 P1.PAD_PU4
  Bottom 0.254: U1.P$21 16.07,7.53 14.3,5.76 v7.21,5.76
UART5_RX
  Bottom 0.254: U1.P$40 16.07,22 17.62,23.56 28.3,23.56 P1.PAD_PD1
UART5_TX  (via drill 0.35)
  Top 0.254: v27.15,24.22 29.22,22.15 P1.PAD_PU1
  Bottom 0.254: U1.P$39 15.57,22.27 17.5,24.19 27.13,24.19 v27.15,24.22
VDD  (via drill 0.35)
  Top 0.61: FB1.2 29.5,15 P1.PAD_PU8 | P1.PAD_PU9 v26.67,2.4 | v32.85,13.26 P1.PAD_PU8 | P1.PAD_PU8 v32.86,16.83 | v26.64,27.5 P1.PAD_PU7 v23.55,29.4 | v11.09,29.4 P1.PAD_PU12 v8.09,27.57 | v1.79,16.74 P1.PAD_PU11 v1.75,13.15 | v7.9,2.38 P1.PAD_PU10
  Route2 0.61: v26.67,2.4 v32.85,13.26 | v32.86,16.83 v26.64,27.5 | v23.55,29.4 v11.09,29.4 | v8.09,27.57 5.47,23.05 | 5.47,23.05 5.43,22.98 v1.79,16.74 | v1.75,13.15 v7.9,2.38 7.9,2.92 12.8,7.82 v12.8,9.34 | 5.47,23.05 v12.42,18.99 v21.43,18.99
  Bottom 0.254: U1.P$24 14.4,11.55 C6.1 | U1.P$1 20.93,17.75 21.42,18.24 | U1.P$36 13.87,18.68 13.64,18.9 C5.1 | C3.1 20.07,19.63 U1.P$48
  Bottom 0.305: 21.42,18.24 21.42,18.98 v21.43,18.99
  Bottom 0.61: C7.1 11.48,19.9 12.4,18.99 v12.42,18.99 13.4,18.99 C5.1 | C4.1 12.8,8.51 v12.8,9.34 13.18,9.72 13.18,10.33 C6.1 | C3.1 20.92,18.99 v21.43,18.99 22.17,18.99 C9.1
VDDA  (via drill 0.35)
  Top 0.305: U2.39 14.35,18.05 14.05,18.35 13.32,18.35 v12.99,18.03
  Top 0.61: v28.42,12.26 29.43,13.27 FB1.1 | v12.99,18.03 12.61,17.65 11.16,17.65 11.15,17.63 C18.1 10.81,17.72 10,17.72 8.99,18.73 R5.2
  Route15 0.61: v12.99,18.03 17.19,18.03 21.94,13.27 v21.94,12.72
  Bottom 0.254: U1.P$9 21.21,13.75 21.94,13.02 v21.94,12.72
  Bottom 0.61: v21.94,12.72 23.85,10.81 C1.1 26.14,10.81 C2.1 27.15,10.99 v28.42,12.26
VSSA  (via drill 0.35)
  Bottom 0.254: U1.P$8 21.47,14.25 22.32,13.4 v23.09,13.4 23.3,13.4 C1.2
  Bottom 0.61: R2.2 17.33,3.48 PWR.2 | C1.2 25.94,12.51 C2.2 v27.4,12.89
  other vias: 7.59,14.29 9.75,14.29 9.12,9.08 23.97,9.72 15.59,4.76 19.15,4.76 11.15,26.1 12.93,26.1 11.15,23.81 25.5,9.72 20.42,9.21 16.99,9.34 13.81,22.04 25.75,20.38 22.32,27.75
  pour Top (isolate 0.254, no thermals): 8.66,0 25.98,0 34.64,15 25.98,30 8.66,30 0,15
  pour Route2 (isolate 0.254, rank 2, no thermals): 8.66,0 25.98,0 34.64,15 25.98,30 8.66,30 0,15

### Text on the board
tPlace: 3V3 | 3V3 | P1 | P4* | 3V3 | 3V3 | P2* | P3 | 3V3 | 3V3
bPlace: V/I- | V/I+ | GND | GND | H15R80 | P1 | P4* | GND | GND | P2* | P3 | -15V | GND | +15V | GND | GND
bNames: C | B | D | R
Document: Total Thickness 1.6 mm / --------------------------------------------------------- / / copper_top_l1.gbr : Top Conductor - Copper: Thickness 0.035 mm / / Dielectric - FR-4: Thickness 0.175 mm / / copper_inner_l2.gbr : GND Plane - Copper: Thickness 0.035 mm / / Dielectric - FR-4: Thickness 1.11 mm / / copper_inner_l3.gbr : VDD Plane - Copper: Thickness 0.035 mm / / Dielectric - FR-4: Thickness 0.175 mm / / copper_bottom_l4.gbr : Bottom Conductor - Copper: Thickness 0.035 mm